# EAGLE schematic GW-RFM-V40-Mini004 (EAGLE 7.6.0)
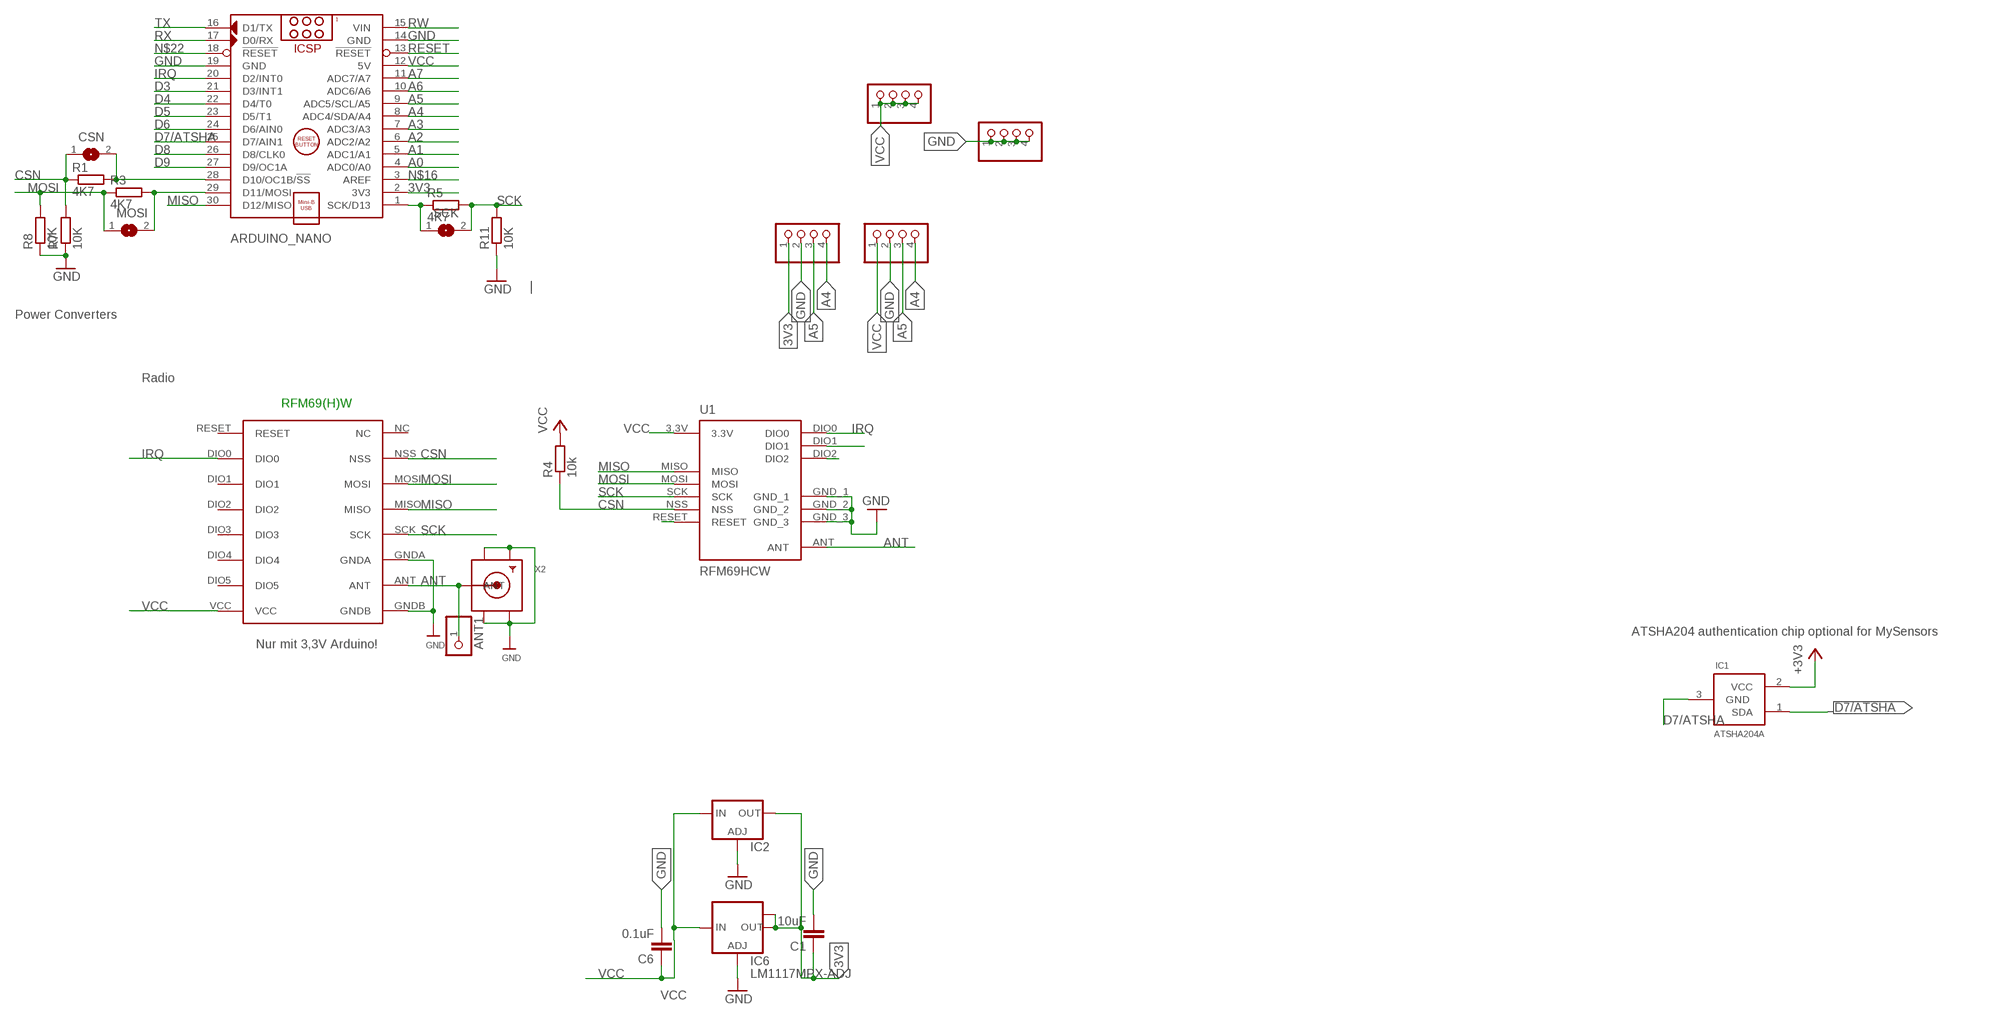
[diagram p0: schematic, sheet 1]

## Parts
ANT1  PINHD-1X1  [1X01]
ARDUINO_NANO  ARDUINO_NANO_OHNE-BOHR  [ARDUINO_NANO]
C1  10uF  C-EUC1210  [C1210]
C6  0.1uF  C-EUC1206  [C1206]
CSN  SJ  [SJ]
IC1  ATSHA204A  [SOT23]
IC2  LD117ADT50TR  [DPACK]
IC6  LM1117MPX-ADJ  [SOT223]
JP1  PINHD-1X04_2.54-S  [1X04-S]
JP3  PINHD-1X04_2.54-S  [1X04-S]
JP17  PINHD-1X04_2.54-S  [1X04-S]
JP18  PINHD-1X04_2.54-S  [1X04-S]
MOSI  SJ  [SJ]
R1  4K7  R-EU_M0805  [M0805]
R3  4K7  R-EU_M0805  [M0805]
R4  10k  R-EU_M0805  [M0805]
R5  4K7  R-EU_M0805  [M0805]
R7  10K  R-EU_M0805  [M0805]
R8  10K  R-EU_M0805  [M0805]
R11  10K  R-EU_M0805  [M0805]
RFM69W  RFM69HW  [RFM]
SCK  SJ  [SJ]
U1  RFM69HCW  [RFM69HCW-XXXS2]
X2  SMACONNECTOR_EDGE  [SMA_EDGELAUNCH]

## Nets
3V3: ARDUINO_NANO.2(3V3) C1.1 IC2.4(OUT) IC6.2(OUT) IC6.TAB(OUT1) JP17.1
A0: ARDUINO_NANO.4(ADC0/A0)
A1: ARDUINO_NANO.5(ADC1/A1)
A2: ARDUINO_NANO.6(ADC2/A2)
A3: ARDUINO_NANO.7(ADC3/A3)
A4: ARDUINO_NANO.8(ADC4/SDA/A4) JP17.4 JP18.4
A5: ARDUINO_NANO.9(ADC5/SCL/A5) JP17.3 JP18.3
A6: ARDUINO_NANO.10(ADC6/A6)
A7: ARDUINO_NANO.11(ADC7/A7)
ANT: ANT1.1 RFM69W.ANT U1.ANT X2.P(ANT)
CSN: CSN.1 R1.1 R4.1 R7.2 RFM69W.NSS U1.NSS
D3: ARDUINO_NANO.21(D3/INT1)
D4: ARDUINO_NANO.22(D4/T0)
D5: ARDUINO_NANO.23(D5/T1)
D6: ARDUINO_NANO.24(D6/AIN0)
D7/ATSHA: ARDUINO_NANO.25(D7/AIN1) IC1.1(SDA) IC1.3(GND)
D8: ARDUINO_NANO.26(D8/CLK0)
D9: ARDUINO_NANO.27(D9/OC1A)
GND [Power]: ARDUINO_NANO.14(GND) ARDUINO_NANO.19(GND) C1.2 C6.2 IC2.1(ADJ) IC6.1(ADJ) JP1.1 JP1.2 JP1.3 JP1.4 JP17.2 JP18.2 R7.1 R8.1 R11.1 RFM69W.GNDA RFM69W.GNDB U1.GND_1 U1.GND_2 U1.GND_3 X2.GND@1(GND4) X2.GND@2(GND3) X2.GND@3(GND2) X2.GND@4(GND1)
IRQ: ARDUINO_NANO.20(D2/INT0) RFM69W.DIO0 U1.DIO0
MISO: ARDUINO_NANO.30(D12/MISO) RFM69W.MISO U1.MISO
MOSI: MOSI.1 R3.1 R8.2 RFM69W.MOSI U1.MOSI
N$5: ARDUINO_NANO.1(SCK/D13) R5.1 SCK.1
N$8: ARDUINO_NANO.28(D10/OC1B/!SS) CSN.2 R1.2
N$9: ARDUINO_NANO.29(D11/MOSI) MOSI.2 R3.2
N$12: U1.DIO2
N$13: U1.RESET
N$15: U1.DIO1
N$16: ARDUINO_NANO.3(AREF)
N$22: ARDUINO_NANO.18(!RESET)
RESET: ARDUINO_NANO.13(!RESET)
RW: ARDUINO_NANO.15(VIN)
RX: ARDUINO_NANO.17(D0/RX)
SCK: R5.2 R11.2 RFM69W.SCK SCK.2 U1.SCK
TX: ARDUINO_NANO.16(D1/TX)
VCC [Power]: ARDUINO_NANO.12(5V) C6.1 IC1.2(VCC) IC2.3(IN) IC6.3(IN) JP3.1 JP3.2 JP3.3 JP3.4 JP18.1 R4.2 RFM69W.VCC U1.3.3V ; supply symbol labelled +3V3
Unconnected: RFM69W.DIO1 RFM69W.DIO2 RFM69W.DIO3 RFM69W.DIO4 RFM69W.DIO5 RFM69W.NC RFM69W.RESET

## Notes on the sheet
- Power Converters
- Radio
- RFM69(H)W
- ATSHA204 authentication chip optional for MySensors
- Nur mit 3,3V Arduino!

## Library data of the parts
ANT1 = pinhead:PINHD-1X1: PIN HEADER
ARDUINO_NANO = ArduinoNanoV30:ARDUINO_NANO_OHNE-BOHR: Arduino Nano V3.0 Module Overview: The Arduino Nano is a small, complete, and breadboard-friendly board based on the ATmega328 (Arduino Nano 3.x) or ATmega168 (Arduino Nano 2.x). It has more or less the same functionality of the Arduino Duemilanove, but in a different package. It lacks only a DC power jack, and works with a Mini-B USB cable instead of a standard one. The Nano was designed and is being produced by Gravitech <http://www.gravitech.us/arna30wiatp.html>. General specifications: Item Value Microcontroller Atmel ATmega168 or ATmega328 Operating Voltage (logic level) 5 V Input Voltage (recommended) 7-12 V Input Voltage (limits) 6-20 V Digital I/O Pins 14 (of which 6 provide PWM output) Analog Input Pins 8 DC Current per I/O Pin 40 mA Flash Memory 16 KB (ATmega168) or 32 KB (ATmega328) of which 2 KB used by bootloader SRAM 1 KB (ATmega168) or 2 KB (ATmega328) EEPROM 512 bytes (ATmega168) or 1 KB (ATmega328) Clock Speed 16 MHz Dimensions (Inches) 0.73" x 1.70" Dimensions (mm) 18mm x 45mm Overall height About 9 mm (not including pins) Weigth 5 g Power: The Arduino Nano can be powered via the Mini-B USB connection, 6-20V unregulated external power supply (pin 30), or 5V regulated external power supply (pin 27). The power source is automatically selected to the highest voltage source. Memory: The ATmega168 has 16 KB of flash memory for storing code (of which 2 KB is used for the bootloader); the ATmega328 has 32 KB, (also with 2 KB used for the bootloader). The ATmega168 has 1 KB of SRAM and 512 bytes of EEPROM (which can be read and written with the EEPROM library); the ATmega328 has 2 KB of SRAM and 1 KB of EEPROM. Input and Output: Each of the 14 digital pins on the Nano can be used as an input or output, using pinMode(), digitalWrite(), and digitalRead() functions. They operate at 5 volts. Each pin can provide or receive a maximum of 40 mA and has an internal pull-up resistor (disconnected by default) of 20-50 kOhms. In addition, some pins have specialized functions. Visit Arduino - ArduinoBoardNano <https://www.arduino.cc/en/Main/ArduinoBoardNano>
C1 C6 = rcl:C-EU: CAPACITOR, European symbol
CSN MOSI SCK = jumper@1:SJ: SMD solder JUMPER
IC1 = Sensor:ATSHA204A
IC2 = v-reg:LD117A?*: Low drop fixed and adjustable positive voltage regulators 1 A Source: http://www.st.com/stonline/products/literature/ds/7194/ld1117axx.pdf
IC6 = lm1117:LM1117MPX-ADJ
JP1 JP3 JP17 JP18 = pinhead-2:PINHD-1X04: PIN HEADER
R1 R3-R5 R7 R8 R11 = rcl:R-EU_: RESISTOR, European symbol
RFM69W = hoperf:RFM69HW
U1 = doug:RFM69H
X2 = adafruit:SMACONNECTOR: SMA Connector 90° DIP SMA Connector, 50 Ohm (4UConnector: 07259)

## Net classes
0 default: width 0.305 mm
1 Power: width 0.406 mm